# Altium project prog Adaptor.PrjPcb
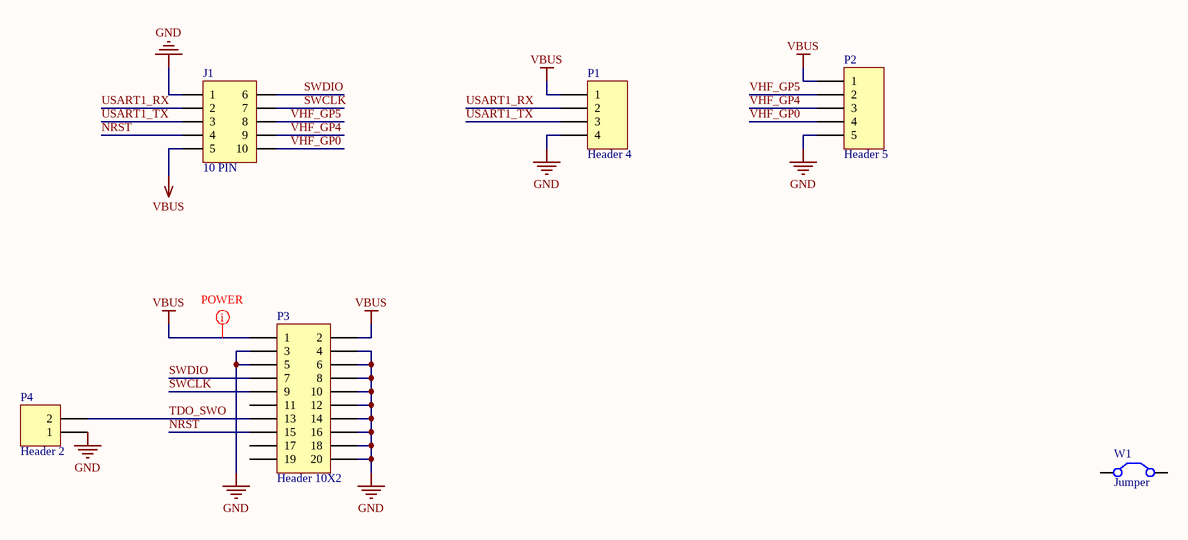
[diagram p0: main.SchDoc]
1 sheet, 6 parts. Net scope: global (net labels, ports and power ports of the same name join across sheets).
Board file: main.PcbDoc

## Sheet main.SchDoc
size A

### Parts
J1  10 PIN  [FTSH-105-01-F-D-K]
P1  Header 4  [HDR1X4]
P2  Header 5  [HDR1X5]
P3  Header 10X2  [HDR2X10]
P4  Header 2  [HDR1X2]
W1  Jumper  [RAD-0.2]  (mechanical)

### Nets
GND: J1.1 P1.4 P2.5 P3.3 P3.4 P3.5 P3.6 P3.8 P3.10 P3.12 P3.14 P3.16 P3.18 P3.20 P4.1
VBUS: J1.5 P1.1 P2.1 P3.1 P3.2
NRST: J1.4 P3.15
SWCLK: J1.7 P3.9
SWDIO: J1.6 P3.7
TDO_SWO: P3.13 P4.2
USART1_RX: J1.2 P1.2
USART1_TX: J1.3 P1.3
VHF_GP0: J1.10 P2.4
VHF_GP4: J1.9 P2.3
VHF_GP5: J1.8 P2.2

Not connected (* = marked no-connect by the designer): P3 11 17 19; W1 1(C1) 2(C2)

### Layout directives
net class POWER: VBUS

### Library data of the parts
J1 = FTSH-105-01-F-D-K: 10 Pin Programming Header; Manufacturer 1: Samtec Inc.; Manufacturer Part Number 1: FTSH-105-01-F-D-K; Supplier 1: Digikey; Supplier Part Number 1: SAM8909-ND
P1 = Header 4: Header, 4-Pin; LatestRevisionDate: 17-Jul-2002; LatestRevisionNote: Re-released for DXP Platform.; Publisher: Altium Limited
P2 = Header 5: Header, 5-Pin; LatestRevisionDate: 17-Jul-2002; LatestRevisionNote: Re-released for DXP Platform.; Publisher: Altium Limited
P3 = Header 10X2: Header, 10-Pin, Dual row; LatestRevisionDate: 17-Jul-2002; LatestRevisionNote: Re-released for DXP Platform.; Publisher: Altium Limited
P4 = Header 2: Header, 2-Pin; LatestRevisionDate: 17-Jul-2002; LatestRevisionNote: Re-released for DXP Platform.; Publisher: Altium Limited
W1 = Jumper: Jumper Wire; Manufacturer 1: Samtec Inc.; Manufacturer Part Number 1: FFSD-05-D-06.00-01-N; Published: 24-Mar-1999; LatestRevisionDate: 17-Jul-2002; LatestRevisionNote: Re-released for DXP Platform.; PackageReference: RAD-0.2; Publisher: Altium Limited; PackageDescription: Radial Cap, Thru-Hole; 2 Leads; 0.2 in Pin Spacing; Supplier 1: Digi-Key; Supplier Part Number 1: SAM8218-ND